# Altium schematic sheet 82.SATA-SATA PM0.SchDoc
size 594 x 420 mm; Revision: V2.1; Schematic Page Number: 11; Page Number: 34; Check: Default; Schematic Name: RK_NVR_DEMO1_RK3588_LP4/4x_V21; Page Count: 43; Page name: 82.SATA-SATA PM0; Designer: Zhangdz; Schematic Page Count: 99; Revcode: V2.1; DsnPath: E:\Work\SBER\RK3588_SOM\temp\RK_NVR_DEMO1_RK3588_LP4XD200P232SD8_V21_20211228.DSN; SchematicName: RK_NVR_DEMO1_RK3588_LP4/4x_V21; PageName: 82.SATA-SATA PM0; PageSize: A2; TopSchematic: True
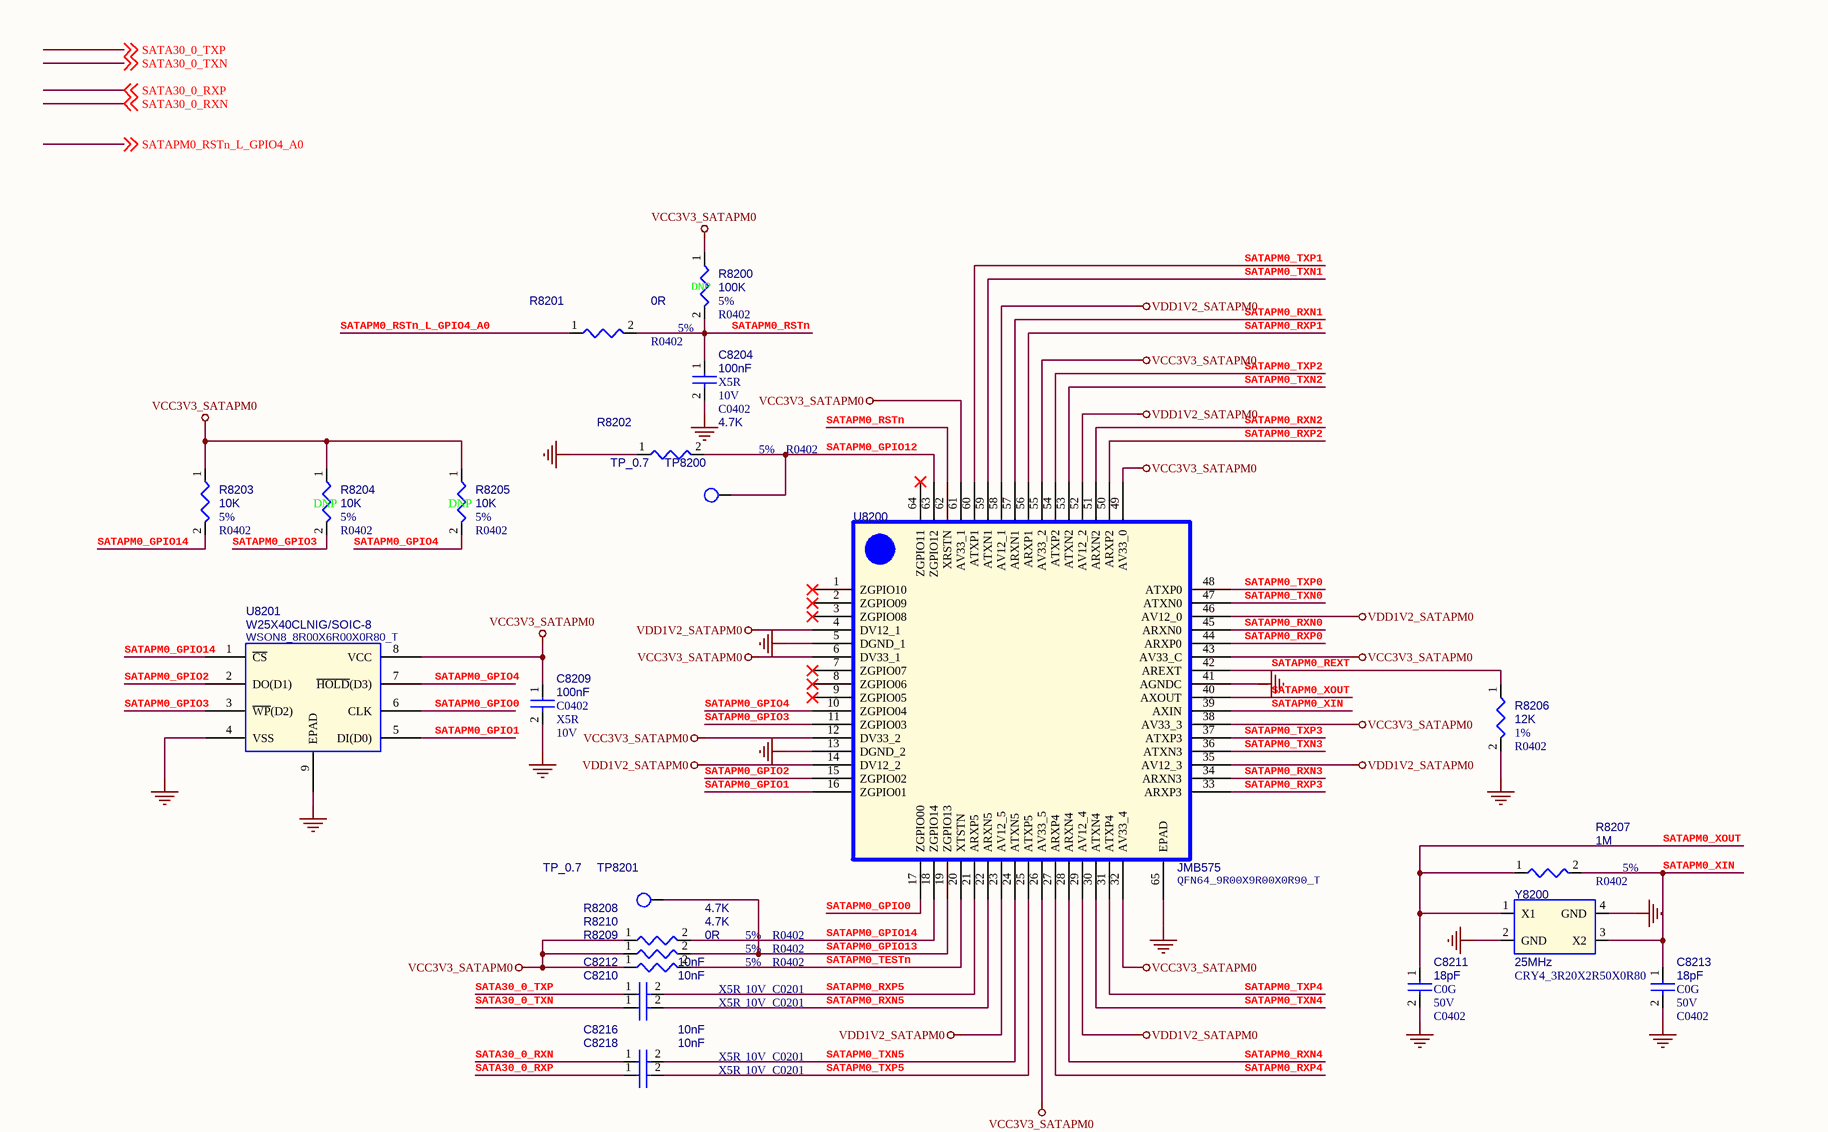
[diagram p0: 82.SATA-SATA PM0.SchDoc, top left]
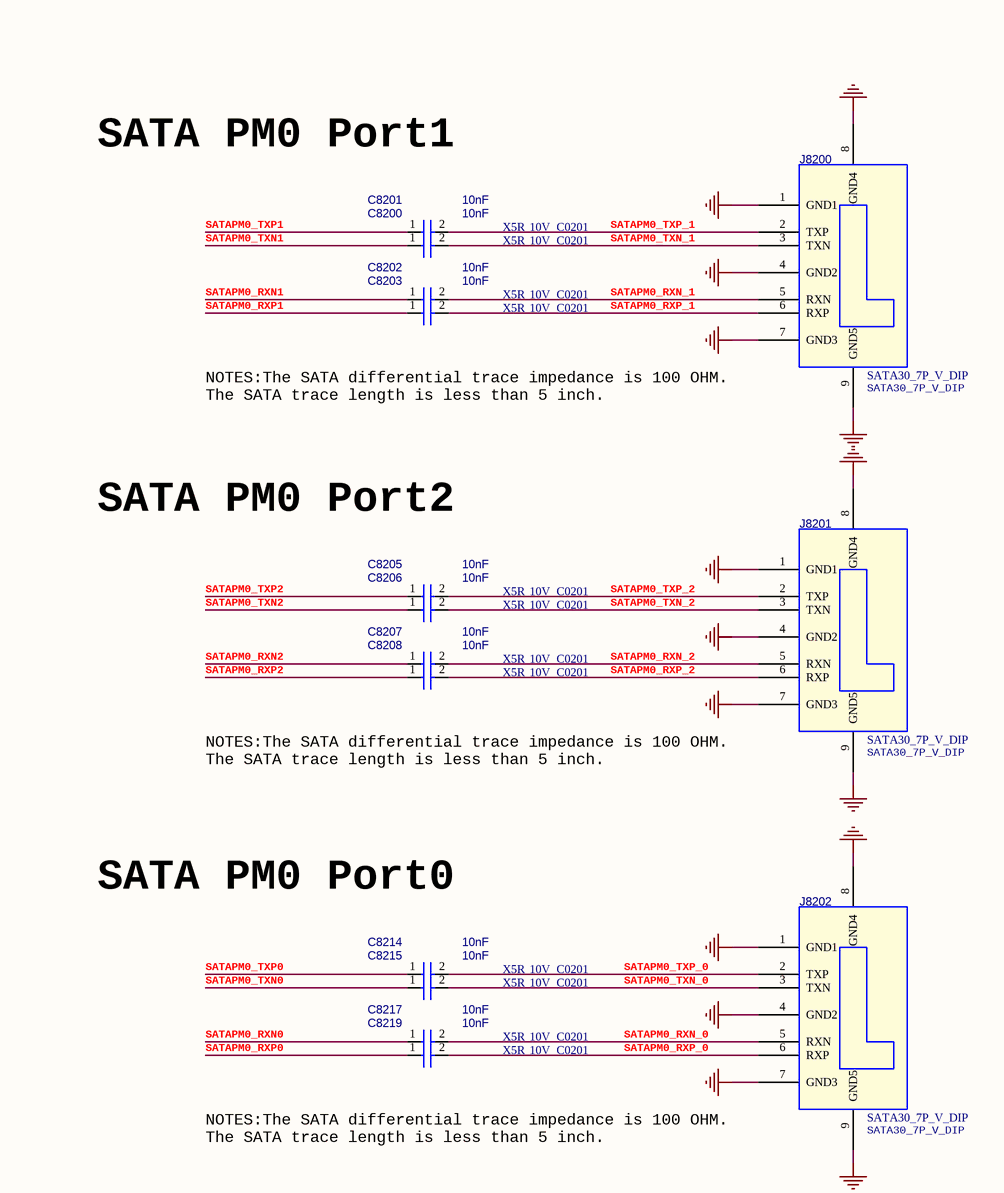
[diagram p1: 82.SATA-SATA PM0.SchDoc, top right]
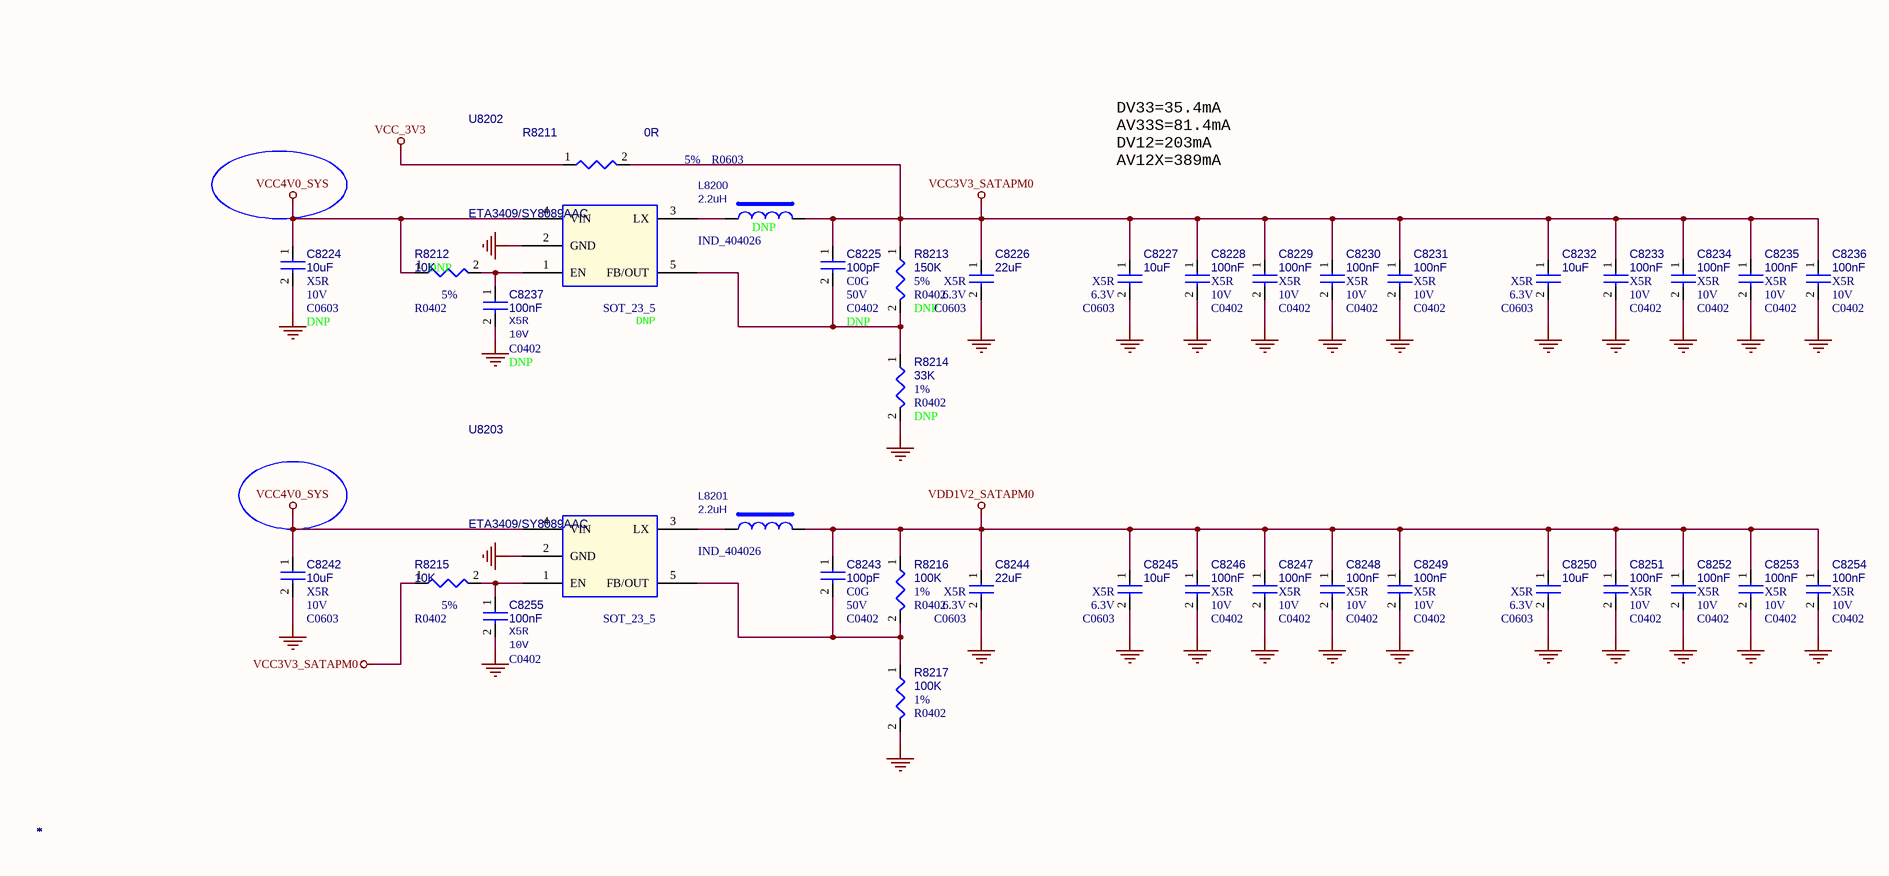
[diagram p2: 82.SATA-SATA PM0.SchDoc, bottom left]
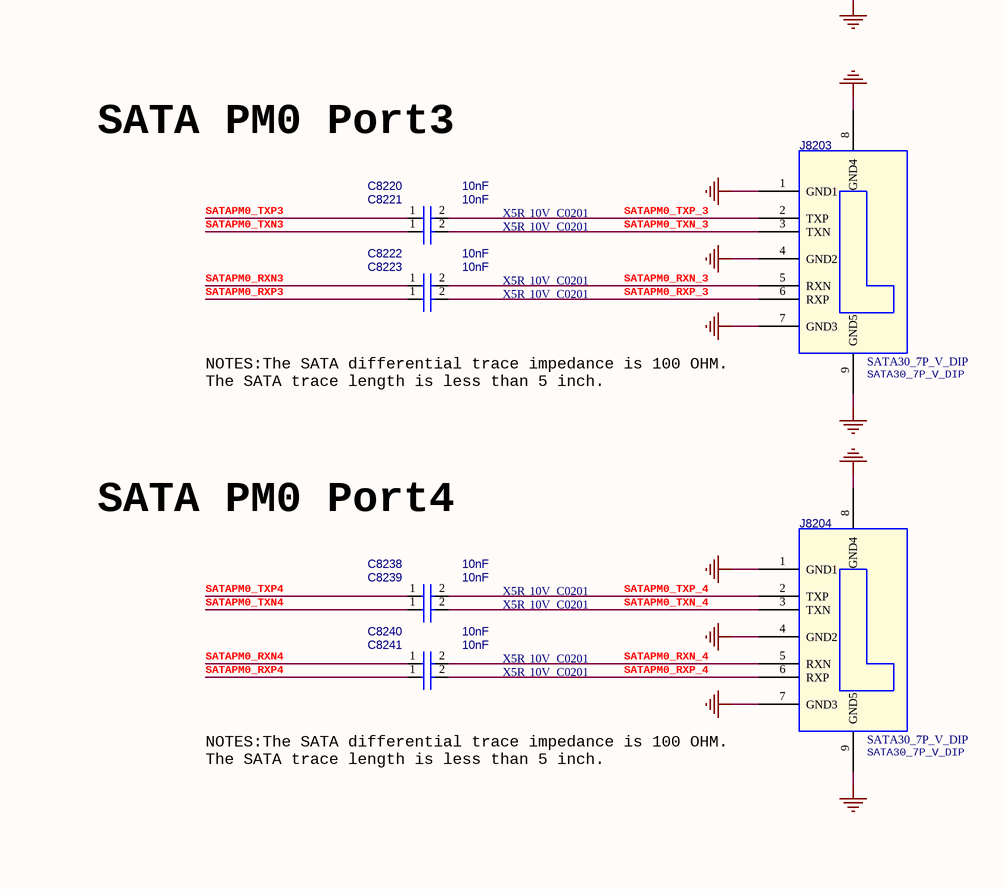
[diagram p3: 82.SATA-SATA PM0.SchDoc, bottom right]

## Parts
C8200  *  Voltage: 10V  Dielectric: X5R  [C0201]
C8201  *  Voltage: 10V  Dielectric: X5R  [C0201]
C8202  *  Voltage: 10V  Dielectric: X5R  [C0201]
C8203  *  Voltage: 10V  Dielectric: X5R  [C0201]
C8204  *  Voltage: 10V  Dielectric: X5R  [C0402]
C8205  *  Voltage: 10V  Dielectric: X5R  [C0201]
C8206  *  Voltage: 10V  Dielectric: X5R  [C0201]
C8207  *  Voltage: 10V  Dielectric: X5R  [C0201]
C8208  *  Voltage: 10V  Dielectric: X5R  [C0201]
C8209  *  Voltage: 10V  Dielectric: X5R  [C0402]
C8210  *  Voltage: 10V  Dielectric: X5R  [C0201]
C8211  *  Voltage: 50V  Dielectric: C0G  [C0402]
C8212  *  Voltage: 10V  Dielectric: X5R  [C0201]
C8213  *  Voltage: 50V  Dielectric: C0G  [C0402]
C8214  *  Voltage: 10V  Dielectric: X5R  [C0201]
C8215  *  Voltage: 10V  Dielectric: X5R  [C0201]
C8216  *  Voltage: 10V  Dielectric: X5R  [C0201]
C8217  *  Voltage: 10V  Dielectric: X5R  [C0201]
C8218  *  Voltage: 10V  Dielectric: X5R  [C0201]
C8219  *  Voltage: 10V  Dielectric: X5R  [C0201]
C8220  *  Voltage: 10V  Dielectric: X5R  [C0201]
C8221  *  Voltage: 10V  Dielectric: X5R  [C0201]
C8222  *  Voltage: 10V  Dielectric: X5R  [C0201]
C8223  *  Voltage: 10V  Dielectric: X5R  [C0201]
C8224  *  Voltage: 10V  Dielectric: X5R  option: DNP  [C0603]
C8225  *  Voltage: 50V  Dielectric: C0G  option: DNP  [C0402]
C8226  *  Voltage: 6.3V  Dielectric: X5R  [C0603]
C8227  *  Voltage: 6.3V  Dielectric: X5R  [C0603]
C8228  *  Voltage: 10V  Dielectric: X5R  [C0402]
C8229  *  Voltage: 10V  Dielectric: X5R  [C0402]
C8230  *  Voltage: 10V  Dielectric: X5R  [C0402]
C8231  *  Voltage: 10V  Dielectric: X5R  [C0402]
C8232  *  Voltage: 6.3V  Dielectric: X5R  [C0603]
C8233  *  Voltage: 10V  Dielectric: X5R  [C0402]
C8234  *  Voltage: 10V  Dielectric: X5R  [C0402]
C8235  *  Voltage: 10V  Dielectric: X5R  [C0402]
C8236  *  Voltage: 10V  Dielectric: X5R  [C0402]
C8237  *  Voltage: 10V  Dielectric: X5R  option: DNP  [C0402]
C8238  *  Voltage: 10V  Dielectric: X5R  [C0201]
C8239  *  Voltage: 10V  Dielectric: X5R  [C0201]
C8240  *  Voltage: 10V  Dielectric: X5R  [C0201]
C8241  *  Voltage: 10V  Dielectric: X5R  [C0201]
C8242  *  Voltage: 10V  Dielectric: X5R  [C0603]
C8243  *  Voltage: 50V  Dielectric: C0G  [C0402]
C8244  *  Voltage: 6.3V  Dielectric: X5R  [C0603]
C8245  *  Voltage: 6.3V  Dielectric: X5R  [C0603]
C8246  *  Voltage: 10V  Dielectric: X5R  [C0402]
C8247  *  Voltage: 10V  Dielectric: X5R  [C0402]
C8248  *  Voltage: 10V  Dielectric: X5R  [C0402]
C8249  *  Voltage: 10V  Dielectric: X5R  [C0402]
C8250  *  Voltage: 6.3V  Dielectric: X5R  [C0603]
C8251  *  Voltage: 10V  Dielectric: X5R  [C0402]
C8252  *  Voltage: 10V  Dielectric: X5R  [C0402]
C8253  *  Voltage: 10V  Dielectric: X5R  [C0402]
C8254  *  Voltage: 10V  Dielectric: X5R  [C0402]
C8255  *  Voltage: 10V  Dielectric: X5R  [C0402]
J8200  *  [SATA30_7P_V_DIP]
J8201  *  [SATA30_7P_V_DIP]
J8202  *  [SATA30_7P_V_DIP]
J8203  *  [SATA30_7P_V_DIP]
J8204  *  [SATA30_7P_V_DIP]
L8200  *  option: DNP  [IND_404026]
L8201  *  [IND_404026]
R8200  *  Tolerance: 5%  Option: DNP  [R0402]
R8201  *  Tolerance: 5%  [R0402]
R8202  *  Tolerance: 5%  [R0402]
R8203  *  Tolerance: 5%  [R0402]
R8204  *  Tolerance: 5%  Option: DNP  [R0402]
R8205  *  Tolerance: 5%  Option: DNP  [R0402]
R8206  *  Tolerance: 1%  [R0402]
R8207  *  Tolerance: 5%  [R0402]
R8208  *  Tolerance: 5%  [R0402]
R8209  *  Tolerance: 5%  [R0402]
R8210  *  Tolerance: 5%  [R0402]
R8211  *  PCB Footprint: R0603  Tolerance: 5%  [R0402]
R8212  *  Tolerance: 5%  option: DNP  [R0402]
R8213  *  Tolerance: 5%  option: DNP  [R0402]
R8214  *  Tolerance: 1%  option: DNP  [R0402]
R8215  *  Tolerance: 5%  [R0402]
R8216  *  Tolerance: 1%  [R0402]
R8217  *  Tolerance: 1%  [R0402]
TP8200  *  [TEST]
TP8201  *  [TEST]
U8200  *  PCB Footprint: QFN64_9R00X9R00X0R90_T  [QFN64]
U8201  *  [WSON8_8R00X6R00X0R80_T]
U8202  *  option: DNP  [SOT_23_5]
U8203  *  [SOT_23_5]
Y8200  *  PCB Footprint: CRY4_3R20X2R50X0R80  [CRY-3225]

## Nets
GND: C8204.2 C8209.2 C8211.2 C8213.2 C8224.2 C8226.2 C8227.2 C8228.2 C8229.2 C8230.2 C8231.2 C8232.2 C8233.2 C8234.2 C8235.2 C8236.2 C8237.2 C8242.2 C8244.2 C8245.2 C8246.2 C8247.2 C8248.2 C8249.2 C8250.2 C8251.2 C8252.2 C8253.2 C8254.2 C8255.2 J8200.1(GND1) J8200.4(GND2) J8200.7(GND3) J8200.8(GND4) J8200.9(GND5) J8201.1(GND1) J8201.4(GND2) J8201.7(GND3) J8201.8(GND4) J8201.9(GND5) J8202.1(GND1) J8202.4(GND2) J8202.7(GND3) J8202.8(GND4) J8202.9(GND5) J8203.1(GND1) J8203.4(GND2) J8203.7(GND3) J8203.8(GND4) J8203.9(GND5) J8204.1(GND1) J8204.4(GND2) J8204.7(GND3) J8204.8(GND4) J8204.9(GND5) R8202.1 R8206.2 R8214.2 R8217.2 U8200.5(DGND_1) U8200.13(DGND_2) U8200.41(AGNDC) U8200.65(EPAD) U8201.4(VSS) U8201.9(EPAD) U8202.2(GND) U8203.2(GND) Y8200.2(GND) Y8200.4(GND)
VCC3V3_SATAPM0: C8209.1 C8225.1 C8226.1 C8227.1 C8228.1 C8229.1 C8230.1 C8231.1 C8232.1 C8233.1 C8234.1 C8235.1 C8236.1 L8200.2 R8200.1 R8203.1 R8204.1 R8205.1 R8208.1 R8209.1 R8210.1 R8211.2 R8213.1 R8215.1 U8200.6(DV33_1) U8200.12(DV33_2) U8200.26(AV33_5) U8200.32(AV33_4) U8200.38(AV33_3) U8200.43(AV33_C) U8200.49(AV33_0) U8200.55(AV33_2) U8200.61(AV33_1) U8201.8(VCC)
VCC4V0_SYS: C8224.1 C8242.1 R8212.1 U8202.4(VIN) U8203.4(VIN)
VCC_3V3: R8211.1
VDD1V2_SATAPM0: C8243.1 C8244.1 C8245.1 C8246.1 C8247.1 C8248.1 C8249.1 C8250.1 C8251.1 C8252.1 C8253.1 C8254.1 L8201.2 R8216.1 U8200.4(DV12_1) U8200.14(DV12_2) U8200.23(AV12_5) U8200.29(AV12_4) U8200.35(AV12_3) U8200.46(AV12_0) U8200.52(AV12_2) U8200.58(AV12_1)
SATA30_0_RXN: C8216.1 ; off-sheet SATA30_0_RXN
SATA30_0_RXP: C8218.1 ; off-sheet SATA30_0_RXP
SATA30_0_TXN: C8210.1 ; off-sheet SATA30_0_TXN
SATA30_0_TXP: C8212.1 ; off-sheet SATA30_0_TXP
SATAPM0_GPIO0: U8200.17(ZGPIO00) U8201.6(CLK)
SATAPM0_GPIO1: U8200.16(ZGPIO01) U8201.5(DI(D0))
SATAPM0_GPIO2: U8200.15(ZGPIO02) U8201.2(DO(D1))
SATAPM0_GPIO3: R8204.2 U8200.11(ZGPIO03) U8201.3(~{WP}(D2))
SATAPM0_GPIO4: R8205.2 U8200.10(ZGPIO04) U8201.7(~{HOLD}(D3))
SATAPM0_GPIO12: R8202.2 TP8200.1 U8200.63(ZGPIO12)
SATAPM0_GPIO13: R8210.2 TP8201.1 U8200.19(ZGPIO13)
SATAPM0_GPIO14: R8203.2 R8208.2 U8200.18(ZGPIO14) U8201.1(~{CS})
SATAPM0_REXT: R8206.1 U8200.42(AREXT)
SATAPM0_RSTn: C8204.1 R8200.2 R8201.2 U8200.62(XRSTN)
SATAPM0_RSTn_L_GPIO4_A0: R8201.1 ; off-sheet SATAPM0_RSTn_L_GPIO4_A0
SATAPM0_RXN0: C8217.1 U8200.45(ARXN0)
SATAPM0_RXN1: C8202.1 U8200.57(ARXN1)
SATAPM0_RXN2: C8207.1 U8200.51(ARXN2)
SATAPM0_RXN3: C8222.1 U8200.34(ARXN3)
SATAPM0_RXN4: C8240.1 U8200.28(ARXN4)
SATAPM0_RXN5: C8210.2 U8200.22(ARXN5)
SATAPM0_RXN_0: C8217.2 J8202.5(RXN)
SATAPM0_RXN_1: C8202.2 J8200.5(RXN)
SATAPM0_RXN_2: C8207.2 J8201.5(RXN)
SATAPM0_RXN_3: C8222.2 J8203.5(RXN)
SATAPM0_RXN_4: C8240.2 J8204.5(RXN)
SATAPM0_RXP0: C8219.1 U8200.44(ARXP0)
SATAPM0_RXP1: C8203.1 U8200.56(ARXP1)
SATAPM0_RXP2: C8208.1 U8200.50(ARXP2)
SATAPM0_RXP3: C8223.1 U8200.33(ARXP3)
SATAPM0_RXP4: C8241.1 U8200.27(ARXP4)
SATAPM0_RXP5: C8212.2 U8200.21(ARXP5)
SATAPM0_RXP_0: C8219.2 J8202.6(RXP)
SATAPM0_RXP_1: C8203.2 J8200.6(RXP)
SATAPM0_RXP_2: C8208.2 J8201.6(RXP)
SATAPM0_RXP_3: C8223.2 J8203.6(RXP)
SATAPM0_RXP_4: C8241.2 J8204.6(RXP)
SATAPM0_TESTn: R8209.2 U8200.20(XTSTN)
SATAPM0_TXN0: C8215.1 U8200.47(ATXN0)
SATAPM0_TXN1: C8200.1 U8200.59(ATXN1)
SATAPM0_TXN2: C8206.1 U8200.53(ATXN2)
SATAPM0_TXN3: C8221.1 U8200.36(ATXN3)
SATAPM0_TXN4: C8239.1 U8200.30(ATXN4)
SATAPM0_TXN5: C8216.2 U8200.24(ATXN5)
SATAPM0_TXN_0: C8215.2 J8202.3(TXN)
SATAPM0_TXN_1: C8200.2 J8200.3(TXN)
SATAPM0_TXN_2: C8206.2 J8201.3(TXN)
SATAPM0_TXN_3: C8221.2 J8203.3(TXN)
SATAPM0_TXN_4: C8239.2 J8204.3(TXN)
SATAPM0_TXP0: C8214.1 U8200.48(ATXP0)
SATAPM0_TXP1: C8201.1 U8200.60(ATXP1)
SATAPM0_TXP2: C8205.1 U8200.54(ATXP2)
SATAPM0_TXP3: C8220.1 U8200.37(ATXP3)
SATAPM0_TXP4: C8238.1 U8200.31(ATXP4)
SATAPM0_TXP5: C8218.2 U8200.25(ATXP5)
SATAPM0_TXP_0: C8214.2 J8202.2(TXP)
SATAPM0_TXP_1: C8201.2 J8200.2(TXP)
SATAPM0_TXP_2: C8205.2 J8201.2(TXP)
SATAPM0_TXP_3: C8220.2 J8203.2(TXP)
SATAPM0_TXP_4: C8238.2 J8204.2(TXP)
SATAPM0_XIN: C8213.1 R8207.2 U8200.39(AXIN) Y8200.3(X2)
SATAPM0_XOUT: C8211.1 R8207.1 U8200.40(AXOUT) Y8200.1(X1)
NetC8225_2: C8225.2 R8213.2 R8214.1 U8202.5(FB/OUT)
NetC8237_1: C8237.1 R8212.2 U8202.1(EN)
NetC8243_2: C8243.2 R8216.2 R8217.1 U8203.5(FB/OUT)
NetC8255_1: C8255.1 R8215.2 U8203.1(EN)
NetL8200_1: L8200.1 U8202.3(LX)
NetL8201_1: L8201.1 U8203.3(LX)

Not connected (* = marked no-connect by the designer): U8200 1(ZGPIO10)* 2(ZGPIO09)* 3(ZGPIO08)* 7(ZGPIO07)* 8(ZGPIO06)* 9(ZGPIO05)* 64(ZGPIO11)*

## Notes on the sheet
- SATA PM0 Port1
- (near J8200) NOTES:The SATA differential trace impedance is 100 OHM.
  The SATA trace length is less than 5 inch.
- SATA PM0 Port2
- (near J8201) NOTES:The SATA differential trace impedance is 100 OHM.
  The SATA trace length is less than 5 inch.
- SATA PM0 Port0
- (near J8202) NOTES:The SATA differential trace impedance is 100 OHM.
  The SATA trace length is less than 5 inch.
- SATA PM0 Port3
- DV33=35.4mA
  AV33S=81.4mA
  DV12=203mA
  AV12X=389mA
- (near J8203) NOTES:The SATA differential trace impedance is 100 OHM.
  The SATA trace length is less than 5 inch.
- SATA PM0 Port4
- (near J8204) NOTES:The SATA differential trace impedance is 100 OHM.
  The SATA trace length is less than 5 inch.

## Library data of the parts
C8200 = CAP NP: cap,10.00nF,+/-10%,10V,X5R,C0201; Part Reference: C8200; Manufacturer PN: C0603X5R1A103K030BA; Manufacturer: TDK; Value: 10nF; Tolerance: 10%; Priority: A; PCB Footprint: C0201; Created by: JJJ; Part Type: C0201; RK PN: C0603X5R1A103K030BA
C8201 = CAP NP: cap,10.00nF,+/-10%,10V,X5R,C0201; Part Reference: C8201; Manufacturer PN: C0603X5R1A103K030BA; Manufacturer: TDK; Value: 10nF; Tolerance: 10%; Priority: A; PCB Footprint: C0201; Created by: JJJ; Part Type: C0201; RK PN: C0603X5R1A103K030BA
C8202 = CAP NP: cap,10.00nF,+/-10%,10V,X5R,C0201; Part Reference: C8202; Manufacturer PN: C0603X5R1A103K030BA; Manufacturer: TDK; Value: 10nF; Tolerance: 10%; Priority: A; PCB Footprint: C0201; Created by: JJJ; Part Type: C0201; RK PN: C0603X5R1A103K030BA
C8203 = CAP NP: cap,10.00nF,+/-10%,10V,X5R,C0201; Part Reference: C8203; Manufacturer PN: C0603X5R1A103K030BA; Manufacturer: TDK; Value: 10nF; Tolerance: 10%; Priority: A; PCB Footprint: C0201; Created by: JJJ; Part Type: C0201; RK PN: C0603X5R1A103K030BA
C8204 = CAP NP: cap,100.00nF,+/-10%,10V,X5R,C0402; Part Reference: C8204; Manufacturer: TDK; Value: 100nF; RK PN: C1005X5R1A104K050BA; Priority: A; Tolerance: 10%; PCB Footprint: C0402; Part Type: C0402; Manufacturer PN: C1005X5R1A104K050BA; Created by: JJJ
C8205 = CAP NP: cap,10.00nF,+/-10%,10V,X5R,C0201; Part Reference: C8205; Manufacturer PN: C0603X5R1A103K030BA; Manufacturer: TDK; Value: 10nF; Tolerance: 10%; Priority: A; PCB Footprint: C0201; Created by: JJJ; Part Type: C0201; RK PN: C0603X5R1A103K030BA
C8206 = CAP NP: cap,10.00nF,+/-10%,10V,X5R,C0201; Part Reference: C8206; Manufacturer PN: C0603X5R1A103K030BA; Manufacturer: TDK; Value: 10nF; Tolerance: 10%; Priority: A; PCB Footprint: C0201; Created by: JJJ; Part Type: C0201; RK PN: C0603X5R1A103K030BA
C8207 = CAP NP: cap,10.00nF,+/-10%,10V,X5R,C0201; Part Reference: C8207; Manufacturer PN: C0603X5R1A103K030BA; Manufacturer: TDK; Value: 10nF; Tolerance: 10%; Priority: A; PCB Footprint: C0201; Created by: JJJ; Part Type: C0201; RK PN: C0603X5R1A103K030BA
C8208 = CAP NP: cap,10.00nF,+/-10%,10V,X5R,C0201; Part Reference: C8208; Manufacturer PN: C0603X5R1A103K030BA; Manufacturer: TDK; Value: 10nF; Tolerance: 10%; Priority: A; PCB Footprint: C0201; Created by: JJJ; Part Type: C0201; RK PN: C0603X5R1A103K030BA
C8209 = CAP NP: cap,100.00nF,+/-10%,10V,X5R,C0402; Part Reference: C8209; Manufacturer: TDK; Value: 100nF; RK PN: C1005X5R1A104K050BA; Priority: A; Tolerance: 10%; PCB Footprint: C0402; Part Type: C0402; Manufacturer PN: C1005X5R1A104K050BA; Created by: JJJ
C8210 = CAP NP: cap,10.00nF,+/-10%,10V,X5R,C0201; Part Reference: C8210; Manufacturer: TDK; Value: 10nF; RK PN: C0603X5R1A103K030BA; Priority: A; Tolerance: 10%; PCB Footprint: C0201; Part Type: C0201; Manufacturer PN: C0603X5R1A103K030BA; Created by: JJJ
C8211 = CAP NP: cap,18.00pF,+/-5%,50V,C0G,C0402; Part Reference: C8211; Manufacturer: TDK; Value: 18pF; RK PN: C1005C0G1H180J050BA; Priority: A; Tolerance: 5%; PCB Footprint: C0402; Part Type: C0402; Manufacturer PN: C1005C0G1H180J050BA; Created by: JJJ
C8212 = CAP NP: cap,10.00nF,+/-10%,10V,X5R,C0201; Part Reference: C8212; Manufacturer: TDK; Value: 10nF; RK PN: C0603X5R1A103K030BA; Priority: A; Tolerance: 10%; PCB Footprint: C0201; Part Type: C0201; Manufacturer PN: C0603X5R1A103K030BA; Created by: JJJ
C8213 = CAP NP: cap,18.00pF,+/-5%,50V,C0G,C0402; Part Reference: C8213; Manufacturer: TDK; Value: 18pF; RK PN: C1005C0G1H180J050BA; Priority: A; Tolerance: 5%; PCB Footprint: C0402; Part Type: C0402; Manufacturer PN: C1005C0G1H180J050BA; Created by: JJJ
C8214 = CAP NP: cap,10.00nF,+/-10%,10V,X5R,C0201; Part Reference: C8214; Manufacturer PN: C0603X5R1A103K030BA; Manufacturer: TDK; Value: 10nF; Tolerance: 10%; Priority: A; PCB Footprint: C0201; Created by: JJJ; Part Type: C0201; RK PN: C0603X5R1A103K030BA
C8215 = CAP NP: cap,10.00nF,+/-10%,10V,X5R,C0201; Part Reference: C8215; Manufacturer PN: C0603X5R1A103K030BA; Manufacturer: TDK; Value: 10nF; Tolerance: 10%; Priority: A; PCB Footprint: C0201; Created by: JJJ; Part Type: C0201; RK PN: C0603X5R1A103K030BA
C8216 = CAP NP: cap,10.00nF,+/-10%,10V,X5R,C0201; Part Reference: C8216; Manufacturer: TDK; Value: 10nF; RK PN: C0603X5R1A103K030BA; Priority: A; Tolerance: 10%; PCB Footprint: C0201; Part Type: C0201; Manufacturer PN: C0603X5R1A103K030BA; Created by: JJJ
C8217 = CAP NP: cap,10.00nF,+/-10%,10V,X5R,C0201; Part Reference: C8217; Manufacturer PN: C0603X5R1A103K030BA; Manufacturer: TDK; Value: 10nF; Tolerance: 10%; Priority: A; PCB Footprint: C0201; Created by: JJJ; Part Type: C0201; RK PN: C0603X5R1A103K030BA
C8218 = CAP NP: cap,10.00nF,+/-10%,10V,X5R,C0201; Part Reference: C8218; Manufacturer: TDK; Value: 10nF; RK PN: C0603X5R1A103K030BA; Priority: A; Tolerance: 10%; PCB Footprint: C0201; Part Type: C0201; Manufacturer PN: C0603X5R1A103K030BA; Created by: JJJ
C8219 = CAP NP: cap,10.00nF,+/-10%,10V,X5R,C0201; Part Reference: C8219; Manufacturer PN: C0603X5R1A103K030BA; Manufacturer: TDK; Value: 10nF; Tolerance: 10%; Priority: A; PCB Footprint: C0201; Created by: JJJ; Part Type: C0201; RK PN: C0603X5R1A103K030BA
C8220 = CAP NP: cap,10.00nF,+/-10%,10V,X5R,C0201; Part Reference: C8220; Manufacturer PN: C0603X5R1A103K030BA; Manufacturer: TDK; Value: 10nF; Tolerance: 10%; Priority: A; PCB Footprint: C0201; Created by: JJJ; Part Type: C0201; RK PN: C0603X5R1A103K030BA
C8221 = CAP NP: cap,10.00nF,+/-10%,10V,X5R,C0201; Part Reference: C8221; Manufacturer PN: C0603X5R1A103K030BA; Manufacturer: TDK; Value: 10nF; Tolerance: 10%; Priority: A; PCB Footprint: C0201; Created by: JJJ; Part Type: C0201; RK PN: C0603X5R1A103K030BA
C8222 = CAP NP: cap,10.00nF,+/-10%,10V,X5R,C0201; Part Reference: C8222; Manufacturer PN: C0603X5R1A103K030BA; Manufacturer: TDK; Value: 10nF; Tolerance: 10%; Priority: A; PCB Footprint: C0201; Created by: JJJ; Part Type: C0201; RK PN: C0603X5R1A103K030BA
C8223 = CAP NP: cap,10.00nF,+/-10%,10V,X5R,C0201; Part Reference: C8223; Manufacturer PN: C0603X5R1A103K030BA; Manufacturer: TDK; Value: 10nF; Tolerance: 10%; Priority: A; PCB Footprint: C0201; Created by: JJJ; Part Type: C0201; RK PN: C0603X5R1A103K030BA
C8224 = CAP NP: cap,10.00uF,+/-10%,10V,X5R,C0603; Part Reference: C8224; Manufacturer PN: C1608X5R1A106K080AC; Manufacturer: TDK; Value: 10uF; Tolerance: 10%; Priority: A; PCB Footprint: C0603; Created by: JJJ; Part Type: C0603; RK PN: C1608X5R1A106K080AC
C8225 = CAP NP: cap,100.00pF,+/-10%,50V,C0G,C0402; Part Reference: C8225; Manufacturer: TDK; Value: 100pF; RK PN: C1005C0G1H101K050BA; Priority: A; Tolerance: 10%; PCB Footprint: C0402; Part Type: C0402; Manufacturer PN: C1005C0G1H101K050BA; Created by: JJJ
C8226 = CAP NP: cap,22.00uF,+/-20%,6.3V,X5R,C0603; Part Reference: C8226; Manufacturer PN: C1608X5R0J226M080AC; Manufacturer: TDK; Value: 22uF; Tolerance: 20%; Priority: A; PCB Footprint: C0603; Created by: JJJ; C_Voltage: 6.3V; Part Type: C0603; RK PN: C1608X5R0J226M080AC
C8227 = CAP NP: cap,10.00uF,+/-10%,6.3V,X5R,C0603; Part Reference: C8227; Manufacturer: TDK; Value: 10uF; RK PN: C1608X5R0J106K080AB; Priority: A; Tolerance: 10%; PCB Footprint: C0603; Part Type: C0603; C_Voltage: 6.3V; Manufacturer PN: C1608X5R0J106K080AB; Created by: JJJ
C8228 = CAP NP: cap,100.00nF,+/-10%,10V,X5R,C0402; Part Reference: C8228; Manufacturer PN: C1005X5R1A104K050BA; Manufacturer: TDK; Value: 100nF; C_Voltage: 6.3V; Tolerance: 10%; Priority: A; Number: 37; PCB Footprint: C0402; Created by: JJJ; Part Type: C0402; RK PN: C1005X5R1A104K050BA
C8229 = CAP NP: cap,100.00nF,+/-10%,10V,X5R,C0402; Part Reference: C8229; Manufacturer PN: C1005X5R1A104K050BA; Manufacturer: TDK; Value: 100nF; C_Voltage: 6.3V; Tolerance: 10%; Priority: A; Number: 37; PCB Footprint: C0402; Created by: JJJ; Part Type: C0402; RK PN: C1005X5R1A104K050BA
C8230 = CAP NP: cap,100.00nF,+/-10%,10V,X5R,C0402; Part Reference: C8230; Manufacturer PN: C1005X5R1A104K050BA; Manufacturer: TDK; Value: 100nF; C_Voltage: 6.3V; Tolerance: 10%; Priority: A; Number: 37; PCB Footprint: C0402; Created by: JJJ; Part Type: C0402; RK PN: C1005X5R1A104K050BA
C8231 = CAP NP: cap,100.00nF,+/-10%,10V,X5R,C0402; Part Reference: C8231; Manufacturer PN: C1005X5R1A104K050BA; Manufacturer: TDK; Value: 100nF; C_Voltage: 6.3V; Tolerance: 10%; Priority: A; Number: 37; PCB Footprint: C0402; Created by: JJJ; Part Type: C0402; RK PN: C1005X5R1A104K050BA
C8232 = CAP NP: cap,10.00uF,+/-10%,6.3V,X5R,C0603; Part Reference: C8232; Manufacturer: TDK; Value: 10uF; RK PN: C1608X5R0J106K080AB; Priority: A; Tolerance: 10%; PCB Footprint: C0603; Part Type: C0603; C_Voltage: 6.3V; Manufacturer PN: C1608X5R0J106K080AB; Created by: JJJ
C8233 = CAP NP: cap,100.00nF,+/-10%,10V,X5R,C0402; Part Reference: C8233; Manufacturer PN: C1005X5R1A104K050BA; Manufacturer: TDK; Value: 100nF; C_Voltage: 6.3V; Tolerance: 10%; Priority: A; Number: 37; PCB Footprint: C0402; Created by: JJJ; Part Type: C0402; RK PN: C1005X5R1A104K050BA
C8234 = CAP NP: cap,100.00nF,+/-10%,10V,X5R,C0402; Part Reference: C8234; Manufacturer PN: C1005X5R1A104K050BA; Manufacturer: TDK; Value: 100nF; C_Voltage: 6.3V; Tolerance: 10%; Priority: A; Number: 37; PCB Footprint: C0402; Created by: JJJ; Part Type: C0402; RK PN: C1005X5R1A104K050BA
C8235 = CAP NP: cap,100.00nF,+/-10%,10V,X5R,C0402; Part Reference: C8235; Manufacturer PN: C1005X5R1A104K050BA; Manufacturer: TDK; Value: 100nF; C_Voltage: 6.3V; Tolerance: 10%; Priority: A; Number: 37; PCB Footprint: C0402; Created by: JJJ; Part Type: C0402; RK PN: C1005X5R1A104K050BA
C8236 = CAP NP: cap,100.00nF,+/-10%,10V,X5R,C0402; Part Reference: C8236; Manufacturer PN: C1005X5R1A104K050BA; Manufacturer: TDK; Value: 100nF; C_Voltage: 6.3V; Tolerance: 10%; Priority: A; Number: 37; PCB Footprint: C0402; Created by: JJJ; Part Type: C0402; RK PN: C1005X5R1A104K050BA
C8237 = CAP NP: cap,100.00nF,+/-10%,10V,X5R,C0402; Part Reference: C8237; Manufacturer PN: C1005X5R1A104K050BA; Manufacturer: TDK; Value: 100nF; Priority: A; Tolerance: 10%; PCB Footprint: C0402; Created by: JJJ; Part Type: C0402; RK PN: C1005X5R1A104K050BA
C8238 = CAP NP: cap,10.00nF,+/-10%,10V,X5R,C0201; Part Reference: C8238; Manufacturer PN: C0603X5R1A103K030BA; Manufacturer: TDK; Value: 10nF; Tolerance: 10%; Priority: A; PCB Footprint: C0201; Created by: JJJ; Part Type: C0201; RK PN: C0603X5R1A103K030BA
C8239 = CAP NP: cap,10.00nF,+/-10%,10V,X5R,C0201; Part Reference: C8239; Manufacturer PN: C0603X5R1A103K030BA; Manufacturer: TDK; Value: 10nF; Tolerance: 10%; Priority: A; PCB Footprint: C0201; Created by: JJJ; Part Type: C0201; RK PN: C0603X5R1A103K030BA
C8240 = CAP NP: cap,10.00nF,+/-10%,10V,X5R,C0201; Part Reference: C8240; Manufacturer PN: C0603X5R1A103K030BA; Manufacturer: TDK; Value: 10nF; Tolerance: 10%; Priority: A; PCB Footprint: C0201; Created by: JJJ; Part Type: C0201; RK PN: C0603X5R1A103K030BA
C8241 = CAP NP: cap,10.00nF,+/-10%,10V,X5R,C0201; Part Reference: C8241; Manufacturer PN: C0603X5R1A103K030BA; Manufacturer: TDK; Value: 10nF; Tolerance: 10%; Priority: A; PCB Footprint: C0201; Created by: JJJ; Part Type: C0201; RK PN: C0603X5R1A103K030BA
C8242 = CAP NP: cap,10.00uF,+/-10%,10V,X5R,C0603; Part Reference: C8242; Manufacturer: TDK; Value: 10uF; RK PN: C1608X5R1A106K080AC; Priority: A; Tolerance: 10%; PCB Footprint: C0603; Part Type: C0603; Manufacturer PN: C1608X5R1A106K080AC; Created by: JJJ
C8243 = CAP NP: cap,100.00pF,+/-10%,50V,C0G,C0402; Part Reference: C8243; Manufacturer PN: C1005C0G1H101K050BA; Manufacturer: TDK; Value: 100pF; Tolerance: 10%; Priority: A; PCB Footprint: C0402; Created by: JJJ; Part Type: C0402; RK PN: C1005C0G1H101K050BA
C8244 = CAP NP: cap,22.00uF,+/-20%,6.3V,X5R,C0603; Part Reference: C8244; Manufacturer: TDK; Value: 22uF; RK PN: C1608X5R0J226M080AC; Priority: A; Tolerance: 20%; PCB Footprint: C0603; Part Type: C0603; C_Voltage: 6.3V; Manufacturer PN: C1608X5R0J226M080AC; Created by: JJJ
C8245 = CAP NP: cap,10.00uF,+/-10%,6.3V,X5R,C0603; Part Reference: C8245; Manufacturer: TDK; Value: 10uF; RK PN: C1608X5R0J106K080AB; Priority: A; Tolerance: 10%; PCB Footprint: C0603; Part Type: C0603; C_Voltage: 6.3V; Manufacturer PN: C1608X5R0J106K080AB; Created by: JJJ
C8246 = CAP NP: cap,100.00nF,+/-10%,10V,X5R,C0402; Part Reference: C8246; Manufacturer PN: C1005X5R1A104K050BA; Manufacturer: TDK; Value: 100nF; C_Voltage: 6.3V; Tolerance: 10%; Priority: A; Number: 37; PCB Footprint: C0402; Created by: JJJ; Part Type: C0402; RK PN: C1005X5R1A104K050BA
C8247 = CAP NP: cap,100.00nF,+/-10%,10V,X5R,C0402; Part Reference: C8247; Manufacturer PN: C1005X5R1A104K050BA; Manufacturer: TDK; Value: 100nF; C_Voltage: 6.3V; Tolerance: 10%; Priority: A; Number: 37; PCB Footprint: C0402; Created by: JJJ; Part Type: C0402; RK PN: C1005X5R1A104K050BA
C8248 = CAP NP: cap,100.00nF,+/-10%,10V,X5R,C0402; Part Reference: C8248; Manufacturer PN: C1005X5R1A104K050BA; Manufacturer: TDK; Value: 100nF; C_Voltage: 6.3V; Tolerance: 10%; Priority: A; Number: 37; PCB Footprint: C0402; Created by: JJJ; Part Type: C0402; RK PN: C1005X5R1A104K050BA
C8249 = CAP NP: cap,100.00nF,+/-10%,10V,X5R,C0402; Part Reference: C8249; Manufacturer PN: C1005X5R1A104K050BA; Manufacturer: TDK; Value: 100nF; C_Voltage: 6.3V; Tolerance: 10%; Priority: A; Number: 37; PCB Footprint: C0402; Created by: JJJ; Part Type: C0402; RK PN: C1005X5R1A104K050BA
C8250 = CAP NP: cap,10.00uF,+/-10%,6.3V,X5R,C0603; Part Reference: C8250; Manufacturer: TDK; Value: 10uF; RK PN: C1608X5R0J106K080AB; Priority: A; Tolerance: 10%; PCB Footprint: C0603; Part Type: C0603; C_Voltage: 6.3V; Manufacturer PN: C1608X5R0J106K080AB; Created by: JJJ
C8251 = CAP NP: cap,100.00nF,+/-10%,10V,X5R,C0402; Part Reference: C8251; Manufacturer PN: C1005X5R1A104K050BA; Manufacturer: TDK; Value: 100nF; C_Voltage: 6.3V; Tolerance: 10%; Priority: A; Number: 37; PCB Footprint: C0402; Created by: JJJ; Part Type: C0402; RK PN: C1005X5R1A104K050BA
C8252 = CAP NP: cap,100.00nF,+/-10%,10V,X5R,C0402; Part Reference: C8252; Manufacturer PN: C1005X5R1A104K050BA; Manufacturer: TDK; Value: 100nF; C_Voltage: 6.3V; Tolerance: 10%; Priority: A; Number: 37; PCB Footprint: C0402; Created by: JJJ; Part Type: C0402; RK PN: C1005X5R1A104K050BA
C8253 = CAP NP: cap,100.00nF,+/-10%,10V,X5R,C0402; Part Reference: C8253; Manufacturer PN: C1005X5R1A104K050BA; Manufacturer: TDK; Value: 100nF; C_Voltage: 6.3V; Tolerance: 10%; Priority: A; Number: 37; PCB Footprint: C0402; Created by: JJJ; Part Type: C0402; RK PN: C1005X5R1A104K050BA
C8254 = CAP NP: cap,100.00nF,+/-10%,10V,X5R,C0402; Part Reference: C8254; Manufacturer PN: C1005X5R1A104K050BA; Manufacturer: TDK; Value: 100nF; C_Voltage: 6.3V; Tolerance: 10%; Priority: A; Number: 37; PCB Footprint: C0402; Created by: JJJ; Part Type: C0402; RK PN: C1005X5R1A104K050BA
C8255 = CAP NP: cap,100.00nF,+/-10%,10V,X5R,C0402; Part Reference: C8255; Manufacturer: TDK; Value: 100nF; Tolerance: 10%; RK PN: C1005X5R1A104K050BA; Priority: A; PCB Footprint: C0402; Part Type: C0402; Manufacturer PN: C1005X5R1A104K050BA; Created by: JJJ
J8200 = SATA_DIP_0: Part Reference: J8200; Value: SATA30_7P_V_DIP; PCB Footprint: SATA30_7P_V_DIP
J8201 = SATA_DIP_0: Part Reference: J8201; Value: SATA30_7P_V_DIP; PCB Footprint: SATA30_7P_V_DIP
J8202 = SATA_DIP_0: Part Reference: J8202; Value: SATA30_7P_V_DIP; PCB Footprint: SATA30_7P_V_DIP
J8203 = SATA_DIP_0: Part Reference: J8203; Value: SATA30_7P_V_DIP; PCB Footprint: SATA30_7P_V_DIP
J8204 = SATA_DIP_0: Part Reference: J8204; Value: SATA30_7P_V_DIP; PCB Footprint: SATA30_7P_V_DIP
L8200 = INDUCTORS OF FERRITE_Dup1: Power Inductor,2.2uH,0.2,IND_404026; Part Reference: L8200; Manufacturer: sunlord; Isat: 2.10A; DC Resistor: 0.04ohm; RK PN: SWPA4026S2R2MT; Priority: A; Tolerance: 20%; Irms: 2A; Resonace frequency: 96M; PCB Footprint: IND_404026; Value: 2.2uH; Part Type: POWER_IND; Manufacturer PN: SWPA4026S2R2MT; Created by: YTL
L8201 = INDUCTORS OF FERRITE_Dup1: Power Inductor,2.2uH,0.2,IND_404026; Part Reference: L8201; Manufacturer PN: SWPA4026S2R2MT; Manufacturer: sunlord; Isat: 2.10A; DC Resistor: 0.04ohm; Resonace frequency: 96M; Irms: 2A; Tolerance: 20%; Priority: A; PCB Footprint: IND_404026; Value: 2.2uH; Created by: YTL; Part Type: POWER_IND; RK PN: SWPA4026S2R2MT
R8200 = RESISTOR_Dup1: НЁУГєсД¤µзЧи,100K,+/-5%,R0402,1/16W.; Part Reference: R8200; Manufacturer PN: RC0402JR-07100KL; Manufacturer: YAGEO; Wattage: 1/16W; Priority: A; PCB Footprint: R0402; Value: 100K; Created by: YTL; Part Type: НЁУГєсД¤µзЧи; RK PN: RC0402JR-07100KL
R8201 = RESISTOR_Dup1: НЁУГєсД¤µзЧи,0R,+/-5%,R0402,1/16W.; Part Reference: R8201; Manufacturer: YAGEO; RK PN: RC0402JR-070RL; Priority: A; Wattage: 1/16W; PCB Footprint: R0402; Value: 0R; Part Type: НЁУГєсД¤µзЧи; Manufacturer PN: RC0402JR-070RL; Created by: YTL
R8202 = RESISTOR_Dup1: НЁУГєсД¤µзЧи,4K7,+/-5%,R0402,1/16W.; Part Reference: R8202; Manufacturer: YAGEO; Value: 4.7K; RK PN: RC0402JR-074K7L; Priority: A; Wattage: 1/16W; PCB Footprint: R0402; Part Type: НЁУГєсД¤µзЧи; Manufacturer PN: RC0402JR-074K7L; Created by: YTL
R8203 = RESISTOR_Dup1: НЁУГєсД¤µзЧи,10K,+/-5%,R0402,1/16W.; Part Reference: R8203; Manufacturer PN: RC0402JR-0710KL; Manufacturer: YAGEO; Wattage: 1/16W; Priority: A; PCB Footprint: R0402; Value: 10K; Created by: YTL; Part Type: НЁУГєсД¤µзЧи; RK PN: RC0402JR-0710KL
R8204 = RESISTOR_Dup1: НЁУГєсД¤µзЧи,10K,+/-5%,R0402,1/16W.; Part Reference: R8204; Manufacturer: YAGEO; RK PN: RC0402JR-0710KL; Priority: A; Wattage: 1/16W; PCB Footprint: R0402; Value: 10K; Part Type: НЁУГєсД¤µзЧи; Manufacturer PN: RC0402JR-0710KL; Created by: YTL
R8205 = RESISTOR_Dup1: НЁУГєсД¤µзЧи,10K,+/-5%,R0402,1/16W.; Part Reference: R8205; Manufacturer PN: RC0402JR-0710KL; Manufacturer: YAGEO; Wattage: 1/16W; Priority: A; PCB Footprint: R0402; Value: 10K; Created by: YTL; Part Type: НЁУГєсД¤µзЧи; RK PN: RC0402JR-0710KL
R8206 = RESISTOR_Dup1: НЁУГєсД¤µзЧи,12K,+/-1%,R0402,1/16W.; Part Reference: R8206; Manufacturer PN: RC0402FR-0712KL; Manufacturer: YAGEO; Wattage: 1/16W; Priority: A; PCB Footprint: R0402; Value: 12K; Created by: YTL; Part Type: НЁУГєсД¤µзЧи; RK PN: RC0402FR-0712KL
R8207 = RESISTOR_Dup1: НЁУГєсД¤µзЧи,1M,+/-5%,R0402,1/16W.; Part Reference: R8207; Manufacturer: YAGEO; RK PN: RC0402JR-071ML; Priority: A; Wattage: 1/16W; PCB Footprint: R0402; Value: 1M; Part Type: НЁУГєсД¤µзЧи; Manufacturer PN: RC0402JR-071ML; Created by: YTL
R8208 = RESISTOR_Dup1: НЁУГєсД¤µзЧи,4K7,+/-5%,R0402,1/16W.; Part Reference: R8208; Manufacturer: YAGEO; Value: 4.7K; RK PN: RC0402JR-074K7L; Priority: A; Wattage: 1/16W; PCB Footprint: R0402; Part Type: НЁУГєсД¤µзЧи; Manufacturer PN: RC0402JR-074K7L; Created by: YTL
R8209 = RESISTOR_Dup1: НЁУГєсД¤µзЧи,0R,+/-5%,R0402,1/16W.; Part Reference: R8209; Manufacturer: YAGEO; RK PN: RC0402JR-070RL; Priority: A; Wattage: 1/16W; PCB Footprint: R0402; Value: 0R; Part Type: НЁУГєсД¤µзЧи; Manufacturer PN: RC0402JR-070RL; Created by: YTL
R8210 = RESISTOR_Dup1: НЁУГєсД¤µзЧи,4K7,+/-5%,R0402,1/16W.; Part Reference: R8210; Manufacturer PN: RC0402JR-074K7L; Manufacturer: YAGEO; Value: 4.7K; Wattage: 1/16W; Priority: A; PCB Footprint: R0402; Created by: YTL; Part Type: НЁУГєсД¤µзЧи; RK PN: RC0402JR-074K7L
R8211 = RESISTOR_Dup1: НЁУГєсД¤µзЧи,0R,+/-5%,R0603,1/10W.; Part Reference: R8211; Manufacturer: YAGEO; RK PN: RC0603JR-070RL; Priority: A; Wattage: 1/10W; Value: 0R; Part Type: НЁУГєсД¤µзЧи; Manufacturer PN: RC0603JR-070RL; Created by: YTL
R8212 = RESISTOR_Dup1: НЁУГєсД¤µзЧи,10K,+/-5%,R0402,1/16W.; Part Reference: R8212; Manufacturer PN: RC0402JR-0710KL; Manufacturer: YAGEO; Wattage: 1/16W; Priority: A; PCB Footprint: R0402; Value: 10K; Created by: YTL; Part Type: НЁУГєсД¤µзЧи; RK PN: RC0402JR-0710KL
R8213 = RESISTOR_Dup1: НЁУГєсД¤µзЧи,150K,+/-5%,R0402,1/16W.; Part Reference: R8213; Manufacturer PN: RC0402JR-07150KL; Manufacturer: YAGEO; Wattage: 1/16W; Priority: A; PCB Footprint: R0402; Value: 150K; Created by: YTL; Part Type: НЁУГєсД¤µзЧи; RK PN: RC0402JR-07150KL
R8214 = RESISTOR_Dup1: НЁУГєсД¤µзЧи,33K,+/-1%,R0402,1/16W.; Part Reference: R8214; Manufacturer: YAGEO; RK PN: RC0402FR-0733KL; Priority: A; Wattage: 1/16W; PCB Footprint: R0402; Value: 33K; Part Type: НЁУГєсД¤µзЧи; Manufacturer PN: RC0402FR-0733KL; Created by: YTL
R8215 = RESISTOR_Dup1: НЁУГєсД¤µзЧи,10K,+/-5%,R0402,1/16W.; Part Reference: R8215; Manufacturer: YAGEO; RK PN: RC0402JR-0710KL; Priority: A; Wattage: 1/16W; PCB Footprint: R0402; Value: 10K; Part Type: НЁУГєсД¤µзЧи; Manufacturer PN: RC0402JR-0710KL; Created by: YTL
R8216 = RESISTOR_Dup1: НЁУГєсД¤µзЧи,100K,+/-1%,R0402,1/16W.; Part Reference: R8216; Manufacturer PN: RC0402FR-07100KL; Manufacturer: YAGEO; Wattage: 1/16W; Priority: A; PCB Footprint: R0402; Value: 100K; Created by: YTL; Part Type: НЁУГєсД¤µзЧи; RK PN: RC0402FR-07100KL
R8217 = RESISTOR_Dup1: НЁУГєсД¤µзЧи,100K,+/-1%,R0402,1/16W.; Part Reference: R8217; Manufacturer PN: RC0402FR-07100KL; Manufacturer: YAGEO; Wattage: 1/16W; Priority: A; PCB Footprint: R0402; Value: 100K; Created by: YTL; Part Type: НЁУГєсД¤µзЧи; RK PN: RC0402FR-07100KL
TP8200 = TP: Test Point 0.7mm; Part Reference: TP8200; PCB Footprint: TP_0R70; Value: TP_0.7; Priority: A; RK PN: TESTPOINT_0R7; Created by: JJJ; Part Type: TP
TP8201 = TP: Test Point 0.7mm; Part Reference: TP8201; PCB Footprint: TP_0R70; Value: TP_0.7; RK PN: TESTPOINT_0R7; Priority: A; Part Type: TP; Created by: JJJ
U8200 = JMB575: Part Reference: U8200; Value: JMB575
U8201 = SPI_FLASH_8PIN_T_0: 256M-bit Serial Flash;32M-byte;3.3V Uniform Sector;Dual and Quad Serial Flash;; Part Reference: U8201; Manufacturer: GigaDevice; Value: W25X40CLNIG/SOIC-8; RK PN: GD25Q256CYGR; Priority: A; PCB Footprint: WSON8_8R00X6R00X0R80_T; Part Type: SPI_FLASH; Manufacturer PN: GD25Q256CYGR; Created by: JJJ
U8202 = DCDC_SY8088: High Efficiency 5.5V, 2A continuous, 3A peak, 1MHz Synchronous Step Down Regulator; Part Reference: U8202; Manufacturer: SilergyЈЁОщБ¦ЅЬЈ©; Value: ETA3409/SY8089AAC; RK PN: SY8089AAC; Priority: A; PCB Footprint: SOT_23_5; Part Type: DCDC; Manufacturer PN: SY8089AAC; Created by: JJJ
U8203 = DCDC_SY8088: High Efficiency 5.5V, 2A continuous, 3A peak, 1MHz Synchronous Step Down Regulator; Part Reference: U8203; Manufacturer PN: SY8089AAC; Manufacturer: SilergyЈЁОщБ¦ЅЬЈ©; Value: ETA3409/SY8089AAC; Priority: A; PCB Footprint: SOT_23_5; Created by: JJJ; Part Type: DCDC; RK PN: SY8089AAC
Y8200 = CRYSTAL_4P: ОЮФґѕ§ХсЈ¬25MЈ¬3225,ЎА10ppmЈ¬10pFЈ¬Hosonic; Part Reference: Y8200; Manufacturer PN: E3SB25.0000F10E11; Manufacturer: Hosonic(єиРЗµзЧУ); Value: 25MHz; Priority: A; Created by: JJJ; Part Type: CRYSTAL; RK PN: E3SB25.0000F10E11